# EasyEDA Pro project ProPrj_ProPrj_ProDoc_V12C_2026-06-01.epro

# Schematic Schematic2_flat_3
Board Name: Board2_oval_flat_3; Create Date: 2026-06-01; Page Name: Board2_flat_3; Project Name: ProPrj_ProDoc_最终版审核; Schematic Name: Schematic2_flat_3; Update Date: 2026-06-01; Company: EasyEDA.com; Page Size: A4; Version: V1.2WA
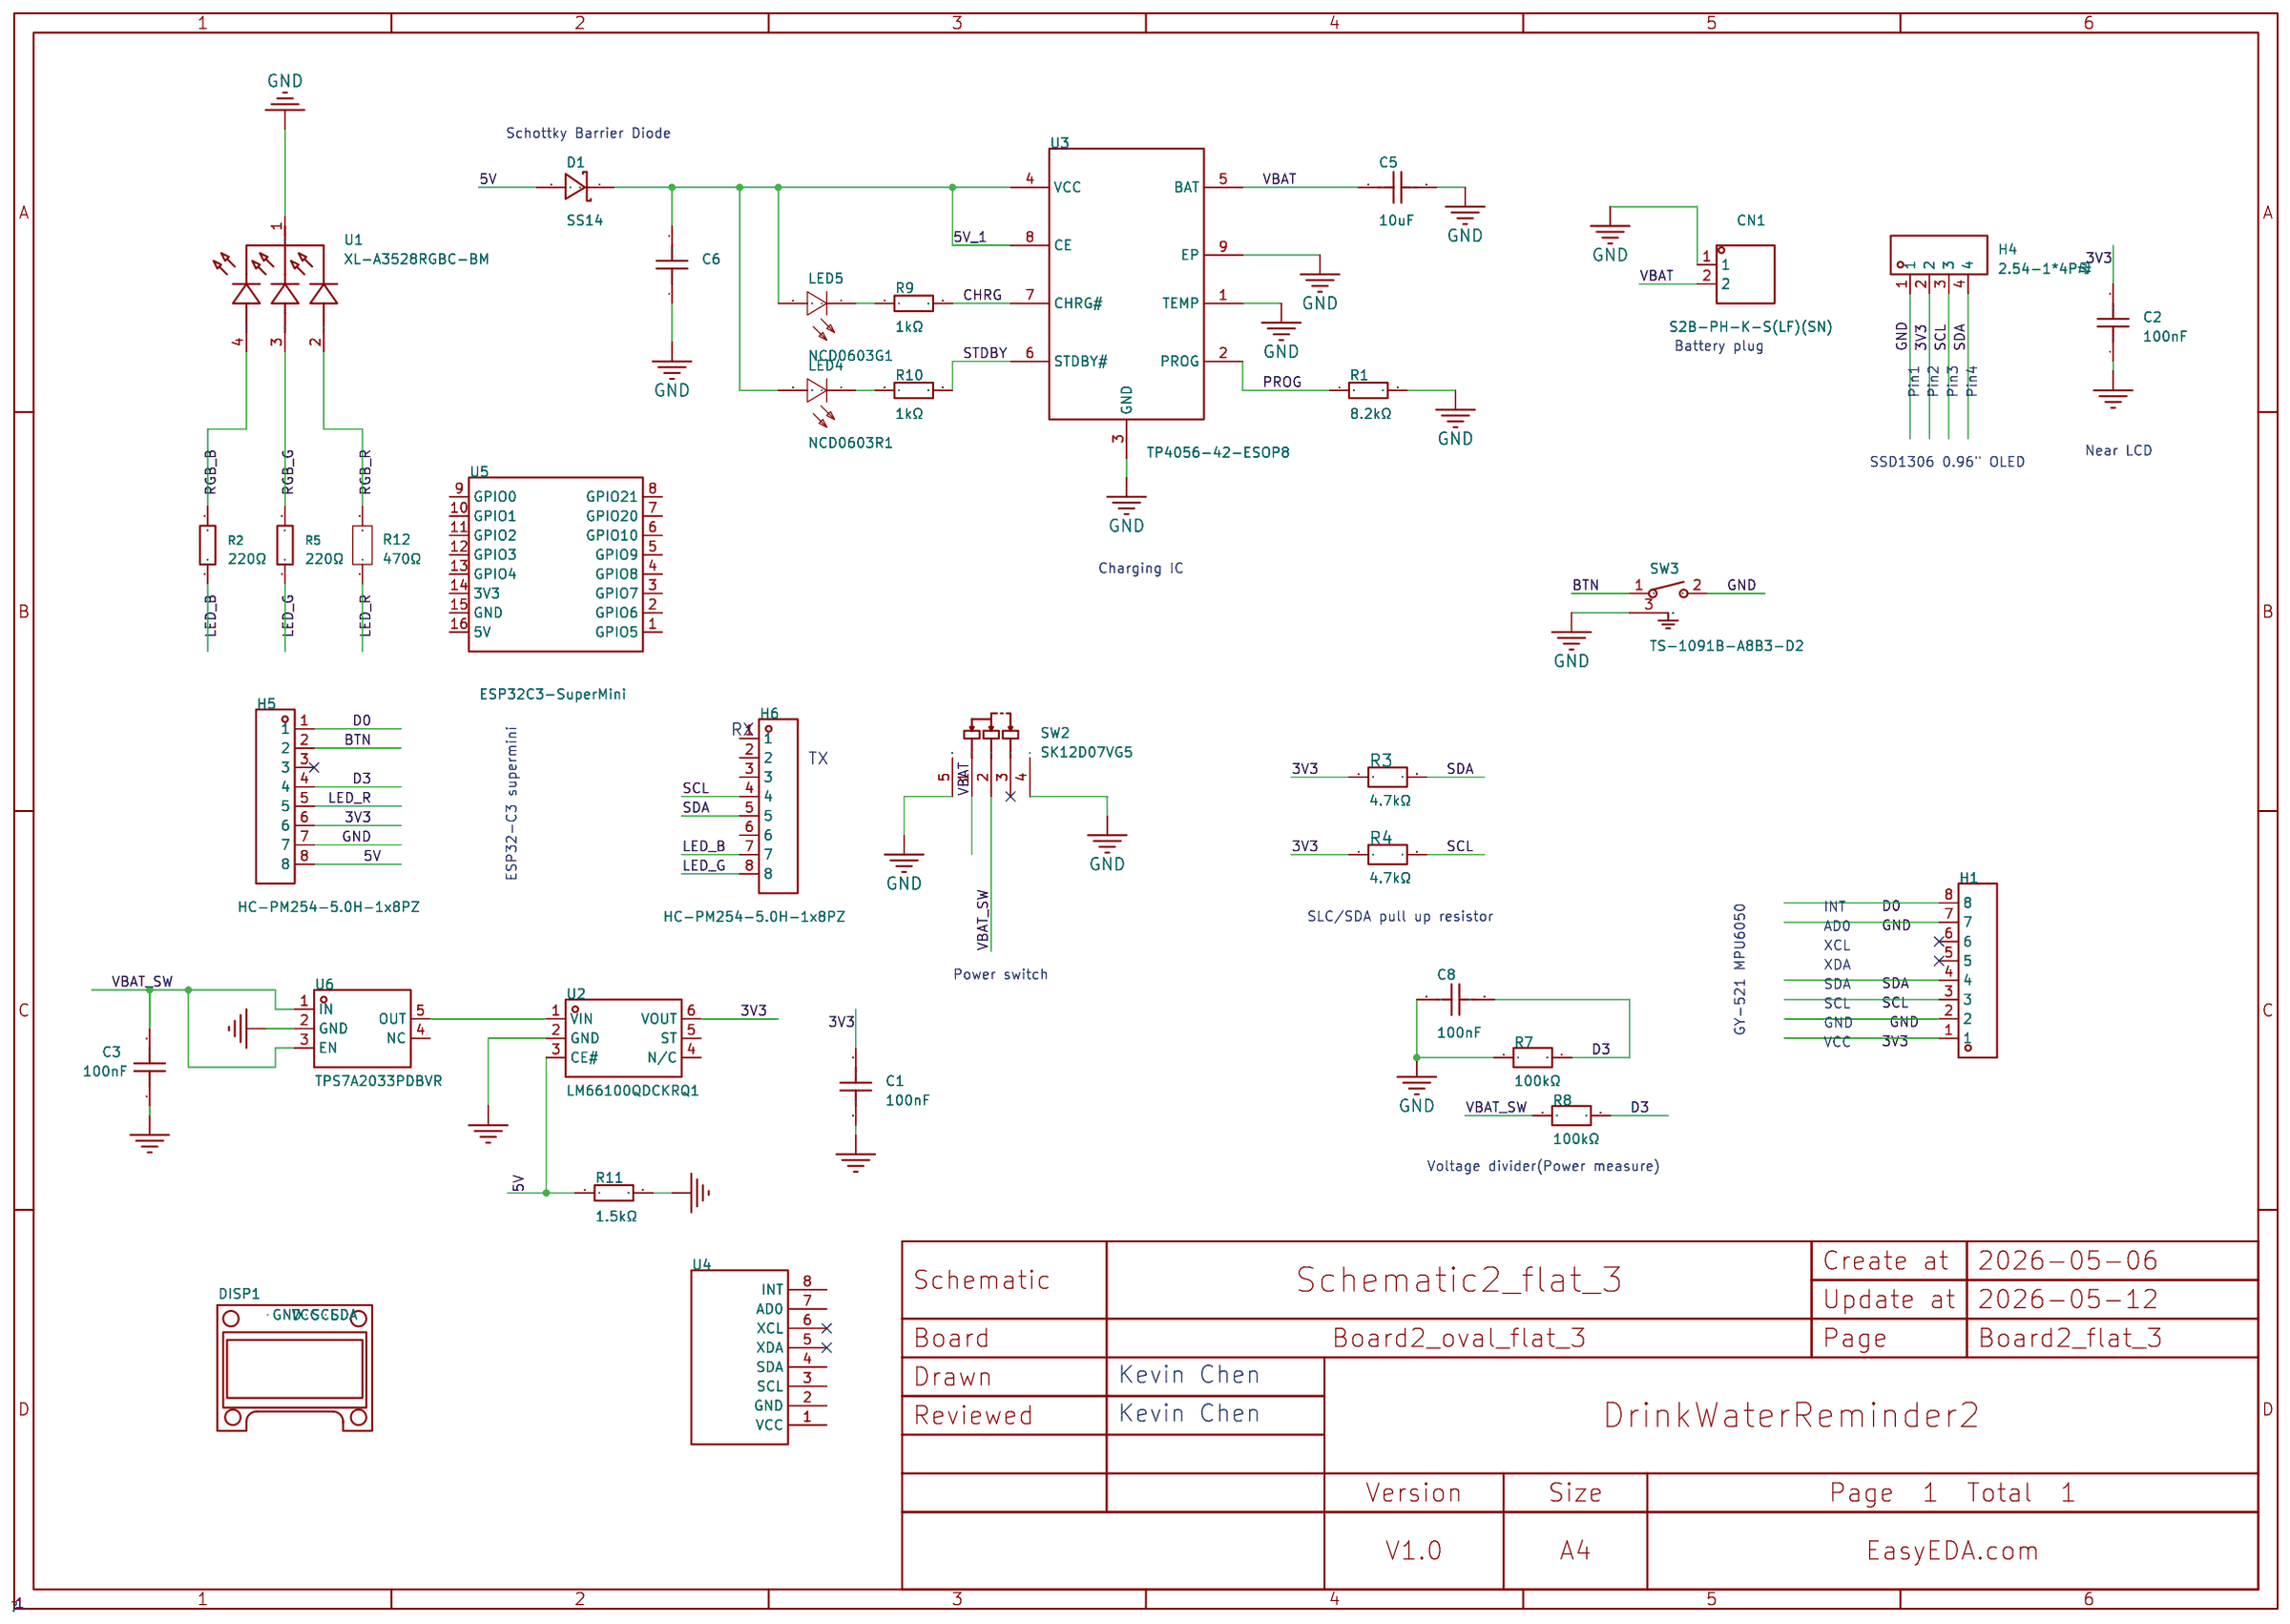
[diagram p0: schematic sheet]

## Parts
C1  100nF  [C0603]
C2  100nF  [C0603]
C3  100nF  [C0603]
C5  10uF  [C0603]
C6  10uF  [C0603]
C8  100nF  [C0603]
CN1  S2B-PH-K-S(LF)(SN)  [CONN-TH_S2B-PH-K-S-LF-SN]
D1  SS14  [SMA_L4.2-W2.6-LS5.0-RD_1]
DISP1  -  [SSD1306 OLED 128x64 Module]  (no BOM)
H1  HC-PM254-5.0H-1x8PZ  [CONN-TH_HC-PM254-1X08-8.5HZ]
H4  2.54-1*4P母  [HDR-TH_4P-P2.54-V-F]
H5  HC-PM254-5.0H-1x8PZ  [CONN-TH_HC-PM254-1X08-8.5HZ]
H6  HC-PM254-5.0H-1x8PZ  [CONN-TH_HC-PM254-1X08-8.5HZ]
LED4  NCD0603R1  [LED0603-RD_RED]
LED5  NCD0603G1  [LED0603-RD_1]
R1  8.2kΩ  [R0603]
R2  220Ω  [R0603]
R3  4.7kΩ  [R0603]
R4  4.7kΩ  [R0603]
R5  220Ω  [R0603]
R7  100kΩ  [R0603]
R8  100kΩ  [R0603]
R9  1kΩ  [R0603]
R10  1kΩ  [R0603]
R11  1.5kΩ  [R0603]
R12  470Ω  [R0603]
SW2  SK12D07VG5  [SW-TH_SK12D07VG5-1]
SW3  TS-1091B-A8B3-D2  [KEY-TH_L4.5-W6.5-P3.10_TS-1091B-A8B3-D2]
U1  XL-A3528RGBC-BM  [LED-ARRAY-SMD_4P-L3.2-W2.8-LS3.5-BL_XL-A3528RGBC-BM]
U2  LM66100QDCKRQ1  [SC-70-6_L2.0-W1.3-P0.65-LS2.1-BR]
U3  TP4056-42-ESOP8  [ESOP-8_L4.9-W3.9-P1.27-LS6.0-BL-EP]
U4  -  [MPU-6050 module]  (no BOM)
U5  ESP32C3-SuperMini  [COMM-SMD_16P-L22.5-W18.0-P2.54-TL]  (no BOM)
U6  TPS7A2033PDBVR  [SOT-23-5_L2.9-W1.6-P0.95-LS2.8-BR]

## Library data of the parts
C1-C3 = GRM188R71H104KA93D: LCSC Part Name: 100nF ±10% 50V; Supplier Part: C77055; Manufacturer: muRata(村田); Supplier Footprint: 0603; JLCPCB Part Class: Extended Part; Datasheet: https://item.szlcsc.com/datasheet/GRM188R71H104KA93D/78182.html; Supplier: LCSC; Tolerance: ±10%; Voltage Rating: 50V; Temperature Coefficient: X7R
C5 = FCC0603X106K100CT: LCSC Part Name: 10uF ±10% 10V; Supplier Part: C5137565; Manufacturer: FOJAN(富捷); Supplier Footprint: 0603; JLCPCB Part Class: Extended Part; Datasheet: https://item.szlcsc.com/datasheet/FCC0603X106K100CT/5747017.html; Supplier: LCSC; Tolerance: ±10%; Voltage Rating: 10V; Temperature Coefficient: X5R
C6 = FCC0603X106K100CT: Capacitance:10uF Tolerance:±10% Tolerance:±10% Voltage Rating:10V Temperature Coefficient:X5R; LCSC Part Name: 10uF ±10% 10V; Supplier Part: C5137565; Manufacturer: FOJAN(富捷); Supplier Footprint: 0603; JLCPCB Part Class: Extended Part; Datasheet: https://item.szlcsc.com/datasheet/FCC0603X106K100CT/5747017.html; Supplier: LCSC; Tolerance: ±10%; Voltage Rating: 10V; Temperature Coefficient: X5R
C8 = CGA0603X7R104K500JT: LCSC Part Name: 100nF ±10% 50V; Supplier Part: C6119867; Manufacturer: HRE(芯声); Supplier Footprint: 0603; JLCPCB Part Class: Extended Part; Datasheet: https://item.szlcsc.com/datasheet/CGA0603X7R104K500JT/7062573.html; Supplier: LCSC; Tolerance: ±10%; Voltage Rating: 50V; Temperature Coefficient: X7R
CN1 = S2B-PH-K-S(LF)(SN): LCSC Part Name: 1x2P 间距:2mm 弯插 系列:PH; Supplier Part: C173752; Manufacturer: JST; Supplier Footprint: 弯插,P=2mm; Datasheet: https://item.szlcsc.com/datasheet/S2B-PH-K-S(LF)(SN)/185142.html; Supplier: LCSC; Pins Structure: 1x2P; Pitch: 2mm; Mounting Type: Right Angle; Reference Series: PH; Number of Pins: 2P; Number of Rows: 1; Number of PINs Per Row: 2; Current Rating: 2A; Contact Material: Brass; Contact Plating: Tin; Operating Temperature: -25℃~+85℃; Voltage Rating: 100V; Plastic Material: PA66; Flame Retardant Rating: UL94V-0; Supplementary Features: K Pin; Color: White; Z-Height of the Board: 4.8mm; X-Length of Bottom Edge on Board (Spacing Line): 5.9mm; Y-Width of Bottom Edge on Board: 7.6mm
D1 = SS14_C2480: LCSC Part Name: 电压:40V 电流:1A; Supplier Part: C2480; Manufacturer: MDD(辰达半导体); Supplier Footprint: SMA(DO-214AC); JLCPCB Part Class: Basic Part; Datasheet: https://item.szlcsc.com/datasheet/SS14/2857.html; Supplier: LCSC; Diode Configuration: Independent; Voltage - Forward(Vf@If): 550mV@1A; Voltage - DC Reverse(Vr): 40V; Current - Rectified: 1A; Reverse Leakage Current (Ir): 300uA@40V; Operating Junction Temperature Range: -55℃~+150℃; Non-Repetitive Peak Forward Surge Current: 25A
DISP1 = SSD1306 OLED 128x64 Module: PCB Layer: Default
H1 = HC-PM254-5.0H-1x8PZ: Holes Structure:1x8P Pitch:2.54mm Row Spacing:- Circular Hole / Square Hole:Square Hole Mounting Type:Through Hole Number of Rows:1 Number of Positions:8P Current Rating:3A Voltage Rating (Max):- Holes Direction:Top Insulation Height:5mm Contact Material:; LCSC Part Name: 间距2.54mm 1x8Pin 直插 PC3.0 H5.0; Supplier Part: C27985233; Manufacturer: HC(虹成电子); Supplier Footprint: 插件,P=2.54mm; JLCPCB Part Class: Extended Part; Datasheet: https://item.szlcsc.com/datasheet/HC-PM254-5.0H-1x8PZ/29721191.html; Supplier: LCSC; Holes Structure: 1x8P; Pitch: 2.54mm; Circular Hole / Square Hole: Square Hole; Mounting Type: Through Hole; Number of Rows: 1; Number of Positions: 8P; Current Rating: 3A; Holes Direction: Top; Insulation Height: 5mm; Contact Material: Brass; Contact Plating: Gold; Operating Temperature: -40℃~+105℃; PIN Length: 3mm
H4 = 2.54-1*4P母: LCSC Part Name: 间距:2.54mm 1x4P 直插; Supplier Part: C2718488; Manufacturer: BOOMELE(博穆精密); Supplier Footprint: 插件,P=2.54mm; JLCPCB Part Class: Extended Part; Datasheet: https://item.szlcsc.com/datasheet/2.54-1*4P%25E6%25AF%258D/2834502.html; Supplier: LCSC; Holes Structure: 1x4P; Pitch: 2.54mm; Circular Hole / Square Hole: 方孔; Mounting Type: 直插; Number of Rows: 单排; Number of Positions: 4P; Current Rating: 3A; Holes Direction: 顶部; Contact Material: 青铜; Operating Temperature: -40℃~+105℃
H5 H6 = HC-PM254-5.0H-1x8PZ: LCSC Part Name: 间距2.54mm 1x8Pin 直插 PC3.0 H5.0; Supplier Part: C27985233; Manufacturer: HC(虹成电子); Supplier Footprint: 插件,P=2.54mm; JLCPCB Part Class: Extended Part; Datasheet: https://item.szlcsc.com/datasheet/HC-PM254-5.0H-1x8PZ/29721191.html; Supplier: LCSC; Holes Structure: 1x8P; Pitch: 2.54mm; Circular Hole / Square Hole: Square Hole; Mounting Type: Through Hole; Number of Rows: 1; Number of Positions: 8P; Current Rating: 3A; Holes Direction: Top; Insulation Height: 5mm; Contact Material: Brass; Contact Plating: Gold; Operating Temperature: -40℃~+105℃; PIN Length: 3mm
LED4 = NCD0603R1_C84263: Lamp Holder Type:- Illumination Color:Red Voltage - Forward(Vf):1.6V~2.6V Voltage - Forward(Vf):1.6V~2.6V Power(Watts):65mW Forward Current:25mA Wavelength - Dominant:615nm~630nm Wavelength - Dominant:615nm~630nm Peak Wavelength:630nm Diode Configuration:; LCSC Part Name: 片式发光二极管; Supplier Part: C84263; Manufacturer: 国星光电; Supplier Footprint: 0603; JLCPCB Part Class: Extended Part; Datasheet: https://item.szlcsc.com/datasheet/NCD0603R1/85432.html; Supplier: LCSC; Illumination Color: Red; Voltage - Forward(Vf): 1.6V~2.6V; Power(Watts): 65mW; Forward Current: 25mA; Wavelength - Dominant: 615nm~630nm; Peak Wavelength: 630nm; Diode Configuration: Discrete Diode; Luminous Intensity: 220mcd; Viewing Angle: 130°; Operating Temperature: -30℃~+85℃
LED5 = NCD0603G1: Lamp Holder Type:- Illumination Color:Emerald Green Voltage - Forward(Vf):2.6V~3.6V Voltage - Forward(Vf):2.6V~3.6V Power(Watts):72mW Forward Current:20mA Wavelength - Dominant:515nm~530nm Wavelength - Dominant:515nm~530nm Peak Wavelength:520nm Diode Conf; LCSC Part Name: 片式发光二极管; Supplier Part: C84267; Manufacturer: 国星光电; Supplier Footprint: 0603; JLCPCB Part Class: Extended Part; Datasheet: https://item.szlcsc.com/datasheet/NCD0603G1/85436.html; Supplier: LCSC; Illumination Color: Emerald Green; Voltage - Forward(Vf): 2.6V~3.6V; Power(Watts): 72mW; Forward Current: 20mA; Wavelength - Dominant: 515nm~530nm; Peak Wavelength: 520nm; Diode Configuration: Discrete Diode; Luminous Intensity: 900mcd; Viewing Angle: 130°; Operating Temperature: -30℃~+85℃
R1 = RC0603FR-078K2L: LCSC Part Name: 厚膜电阻 8.2kΩ ±1% 100mW; Supplier Part: C114637; Manufacturer: YAGEO(国巨); Supplier Footprint: 0603; JLCPCB Part Class: Extended Part; Datasheet: https://atta.szlcsc.com/upload/public/pdf/source/20180821/C275644_0D56F95EFF785E7D9A1FEF436B37DA78.pdf; Supplier: LCSC; Type: 厚膜电阻; Tolerance: ±1%; Power(Watts): 100mW; Overload Voltage (Max): 75V; Temperature Coefficient: ±100ppm/℃; Operating Temperature Range: -55℃~+155℃
R2 R5 = CR0603FA2200G: LCSC Part Name: 厚膜电阻 220Ω ±1% 100mW; Supplier Part: C100863; Manufacturer: LIZ(丽智电子); Supplier Footprint: 0603; JLCPCB Part Class: Extended Part; Datasheet: https://item.szlcsc.com/datasheet/CR0603FA2200G/102078.html; Supplier: LCSC; Type: Thick Film Resistor; Tolerance: ±1%; Power(Watts): 100mW; Voltage-Supply(Max): 50V; Temperature Coefficient: ±100ppm/℃; Operating Temperature: -55℃~+125℃
R3 R4 = FRC0603J472 TS: LCSC Part Name: 4.7kΩ ±5% 100mW 厚膜电阻; Supplier Part: C2907166; Manufacturer: FOJAN(富捷); Supplier Footprint: 0603; JLCPCB Part Class: Extended Part; Supplier: LCSC; Type: Thick Film Resistor; Tolerance: ±5%; Power(Watts): 100mW; Voltage-Supply(Max): 75V; Temperature Coefficient: ±100ppm/℃; Operating Temperature: -55℃~+155℃
R7 R8 = FRC0603J104 TS: LCSC Part Name: 100kΩ ±5% 100mW 厚膜电阻; Supplier Part: C2907088; Manufacturer: FOJAN(富捷); Supplier Footprint: 0603; JLCPCB Part Class: Extended Part; Supplier: LCSC; Type: Thick Film Resistor; Tolerance: ±5%; Power(Watts): 100mW; Voltage-Supply(Max): 75V; Temperature Coefficient: ±100ppm/℃; Operating Temperature: -55℃~+155℃
R9 R10 = 0603WAF1001T5E: LCSC Part Name: 1kΩ ±1% 100mW 厚膜电阻; Supplier Part: C21190; Manufacturer: UNI-ROYAL(厚声); Supplier Footprint: 0603; JLCPCB Part Class: Basic Part; Datasheet: https://item.szlcsc.com/datasheet/0603WAF1001T5E/21904.html; Supplier: LCSC; Type: Thick Film Resistor; Tolerance: ±1%; Power(Watts): 100mW; Voltage-Supply(Max): 75V; Temperature Coefficient: ±100ppm/℃; Operating Temperature: -55℃~+155℃
R11 = RC0603JR-071K5L: LCSC Part Name: 厚膜电阻 1.5kΩ ±5% 100mW; Supplier Part: C114680; Manufacturer: YAGEO(国巨); Supplier Footprint: 0603; JLCPCB Part Class: Extended Part; Datasheet: https://item.szlcsc.com/datasheet/RC0603JR-071K5L/115924.html; Supplier: LCSC; Type: 厚膜电阻; Tolerance: ±5%; Power(Watts): 100mW; Voltage-Supply(Max): 75V; Temperature Coefficient: ±100ppm/℃; Operating Temperature: -55℃~+155℃
R12 = FRC0603J471 TS: Type:Thick Film Resistor Resistance:470Ω Tolerance:±5% Tolerance:±5% Power(Watts):100mW Voltage-Supply(Max):75V Temperature Coefficient:±100ppm/℃ Temperature Coefficient:±100ppm/℃ Operating Temperature:-55℃~+155℃ Operating Temperature:-55℃~+155℃; LCSC Part Name: 470Ω ±5% 100mW 厚膜电阻; Supplier Part: C2907172; Manufacturer: FOJAN(富捷); Supplier Footprint: 0603; JLCPCB Part Class: Extended Part; Supplier: LCSC; Type: Thick Film Resistor; Tolerance: ±5%; Power(Watts): 100mW; Voltage-Supply(Max): 75V; Temperature Coefficient: ±100ppm/℃; Operating Temperature: -55℃~+155℃
SW2 = SK12D07VG5: Supplier Part: C431548; Manufacturer: SHOU HAN(首韩); Supplier Footprint: 插件,8.7x4.4mm; JLCPCB Part Class: Extended Part; Datasheet: https://item.szlcsc.com/datasheet/SK12D07VG5/427905.html; Supplier: LCSC; Circuit: SPDT; Termination Style: PC Pin; Length: 8.7mm; Width: 4.4mm; Switch Height: 4.7mm; Current Rating: 500mA; Voltage Rating: 50V; Life: 5,000 cycles; Operating Temperature: -10℃~+50℃
SW3 = TS-1091B-A8B3-D2: LCSC Part Name: 4.5*4.5*7mm 卧插 轻触开关; Supplier Part: C557914; Manufacturer: Yuandi(元迪); Supplier Footprint: 插件; JLCPCB Part Class: Extended Part; Datasheet: https://atta.szlcsc.com/upload/public/pdf/source/20230810/62360E7201003165247F8ABBA84191C1.pdf; Supplier: LCSC; Circuit: SPST; Actuator Style: Round Button; Operating Force: 250gf; Mounting Style: Lying; Switch Length: 4.5mm; Switch Width: 4.5mm; Switch Height: 7mm; Strike Gundam: 不带; Actuator/Cap Color: Black; Pin Style: PCPin
U1 = XL-A3528RGBC-BM: LCSC Part Name: 3528七彩贴片式发光二极管; Supplier Part: C3647023; Manufacturer: XINGLIGHT(成兴光); Supplier Footprint: SMD3528-4P; JLCPCB Part Class: Extended Part; Datasheet: https://item.szlcsc.com/datasheet/XL-A3528RGBC-BM/4213938.html; Supplier: LCSC; Diode Configuration: 共阴极; Wavelength - Dominant: B:460nm~470nm；G:515nm~530nm；R:620nm~630nm; Peak Wavelength: G:520nm；B:460nm；R:620nm; Luminous Intensity: G:1300mcd~1800mcd；B:400mcd~500mcd；R:500mcd~600mcd; Viewing Angle: 120°; Lens Color: 无色透明透镜; Forward Current: R:20mA；B:20mA；G:20mA; Forward Voltage(Vf): B:2.8V~3.2V；G:2.8V~3.2V；R:1.8V~2.2V; Antistatic Capacity: B:2000V；R:2000V；G:2000V; Power(Watts): G:70mW；B:70mW；R:50mW; Installation Method: 正贴; Operating Temperature: -40℃~+85℃; Length: 3.5mm; Width: 2.8mm; Height: 1.9mm
U2 = LM66100QDCKRQ1: LCSC Part Name: 具有集成式 FET 的汽车类 1.5V 至 5.5V、1.5A、0.5uA IQ 理想二极管; Supplier Part: C5219211; Manufacturer: TI(德州仪器); Supplier Footprint: SC-70-6; JLCPCB Part Class: Extended Part; Datasheet: https://www.ti.com/cn/lit/gpn/lm66100-q1; Supplier: LCSC
U3 = TP4056-42-ESOP8: LCSC Part Name: 1A线性锂离子电池充电器; Supplier Part: C16581; Manufacturer: TOPPOWER(南京拓微); Supplier Footprint: ESOP-8; JLCPCB Part Class: Extended Part; Datasheet: https://item.szlcsc.com/datasheet/TP4056-42-ESOP8/17264.html; Supplier: LCSC; The Chip Type: Charging IC; Voltage - Supply: 4V~8V; Charge Current - Max: 1A; Charging Saturation Voltage: 4.2V; Type of Battery: Lithium Battery; Number of Cells: 1; Operating Temperature: -40℃~+85℃; Battery Temperature Detection: Support; Supply Current (Iq): 2uA; Features: Constant voltage charging；Constant current charging；Automatic recharge；Charge termination；Soft start；Programmable charging current；Undervoltage lockout；Trickle charging
U4 = MPU-6050 module
U5 = ESP32C3-SuperMini: Supplier Part: C9900147397; Supplier Footprint: SMD-16P; JLCPCB Part Class: Extended Part; Supplier: LCSC
U6 = TPS7A2033PDBVR: LCSC Part Name: 具有高 PSRR 的 300mA、超低噪声、低 IQ、低压降 (LDO) 线性稳压器; Supplier Part: C2862740; Manufacturer: TI(德州仪器); Supplier Footprint: SOT-23-5; JLCPCB Part Class: Extended Part; Datasheet: https://www.ti.com/cn/lit/gpn/tps7a20; Supplier: LCSC; Output Type: 固定; Maximum Input Voltage: 6V; Output Voltage: 3.3V; Output Current: 300mA; Dropout Voltage: 140mV@(300mA); standby current: 15uA; Feature: 防静电保护；软启动；浪涌保护；低ESR；热保护(TSD)；欠压闭锁；过流保护(OCP)；带使能；防倒灌; Operating Temperature: -40℃~+125℃@(Tj); Output Polarity: 正极; Number of Outputs: 1

## Nets
3V3: C1.2 C2.2 H1.1 H4.2 H5.6 R3.1 R4.1 U2.6(VOUT)
5V: D1.2(A) H5.8 R11.1 U2.3(CE#)
5V_1: C6.2 D1.1(K) LED4.2(A) LED5.2(A) U3.4(VCC) U3.8(CE)
GND: C1.1 C2.1 C3.1 C5.2 C6.1 C8.1 CN1.1 H1.2 H1.7 H4.1 H5.7 R1.2 R7.1 R11.2 SW2.4 SW2.5 SW3.2 SW3.3(GND) U1.1 U2.2(GND) U3.1(TEMP) U3.3(GND) U3.9(EP) U6.2(GND)
VBAT: C5.1 CN1.2 SW2.1 U3.5(BAT)
VBAT_SW: C3.2 R8.1 SW2.2 U6.1(IN) U6.3(EN)
BTN: H5.2 SW3.1
CHRG: R9.2 U3.7(CHRG#)
D0: H1.8 H5.1
D3: C8.2 H5.4 R7.2 R8.2
LED_B: H6.7 R2.1
LED_G: H6.8 R5.1
LED_R: H5.5 R12.1
PROG: R1.1 U3.2(PROG)
RGB_B: R2.2 U1.4
RGB_G: R5.2 U1.3
RGB_R: R12.2 U1.2
SCL: H1.3 H4.3 H6.4 R4.2
SDA: H1.4 H4.4 H6.5 R3.2
STDBY: R10.2 U3.6(STDBY#)
$1N21492: LED5.1(K) R9.1
$1N21493: LED4.1(K) R10.1
$1N21507: U2.1(VIN) U6.5(OUT)

Not connected (* = marked no-connect by the designer): DISP1 1(GND) 2(VCC) 3(SCL) 4(SDA); H1 5* 6*; H5 3*; H6 1 2 3 6; SW2 3*; U2 4(N/C) 5(ST); U4 1(VCC) 2(GND) 3(SCL) 4(SDA) 5(XDA)* 6(XCL)* 7(AD0) 8(INT); U5 1(GPIO5) 2(GPIO6) 3(GPIO7) 4(GPIO8) 5(GPIO9) 6(GPIO10) 7(GPIO20) 8(GPIO21) 9(GPIO0) 10(GPIO1) 11(GPIO2) 12(GPIO3) 13(GPIO4) 14(3V3) 15(GND) 16(5V); U6 4(NC)

## Notes on the sheet
- Schottky Barrier Diode
- Battery plug
- Pin1
- Pin2
- Pin3
- Pin4
- SSD1306 0.96" OLED
- Near LCD
- Charging IC
- RX
- TX
- ESP32-C3 supermini
- SLC/SDA pull up resistor
- INT
- AD0
- XCL
- XDA
- Power switch
- SDA
- SCL
- GND
- GY-521 MPU6050
- VCC
- Voltage divider(Power measure)
- Kevin Chen
- Kevin Chen

# Board Board2_flat_3
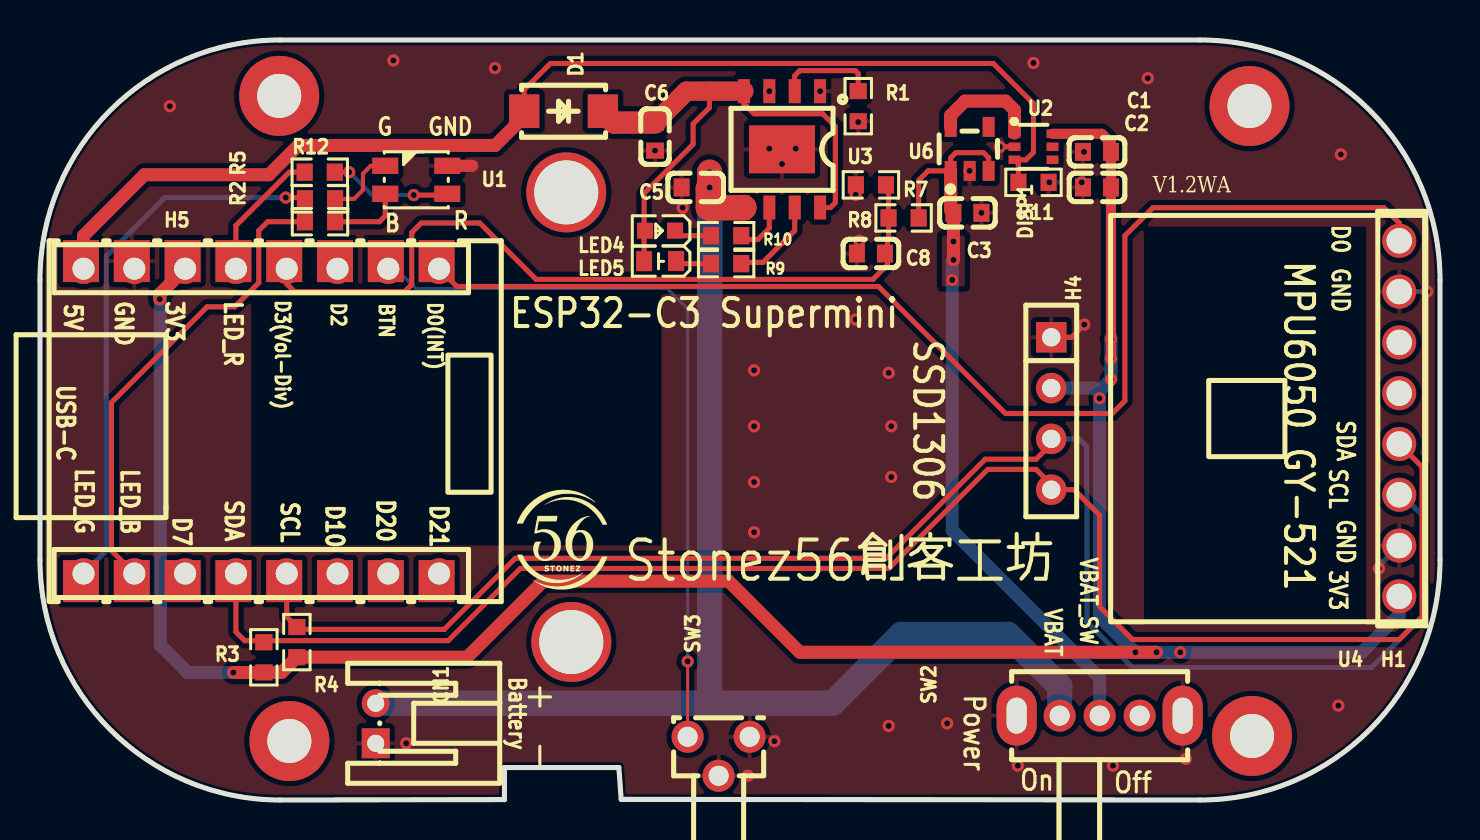
[diagram p1: board, top side]
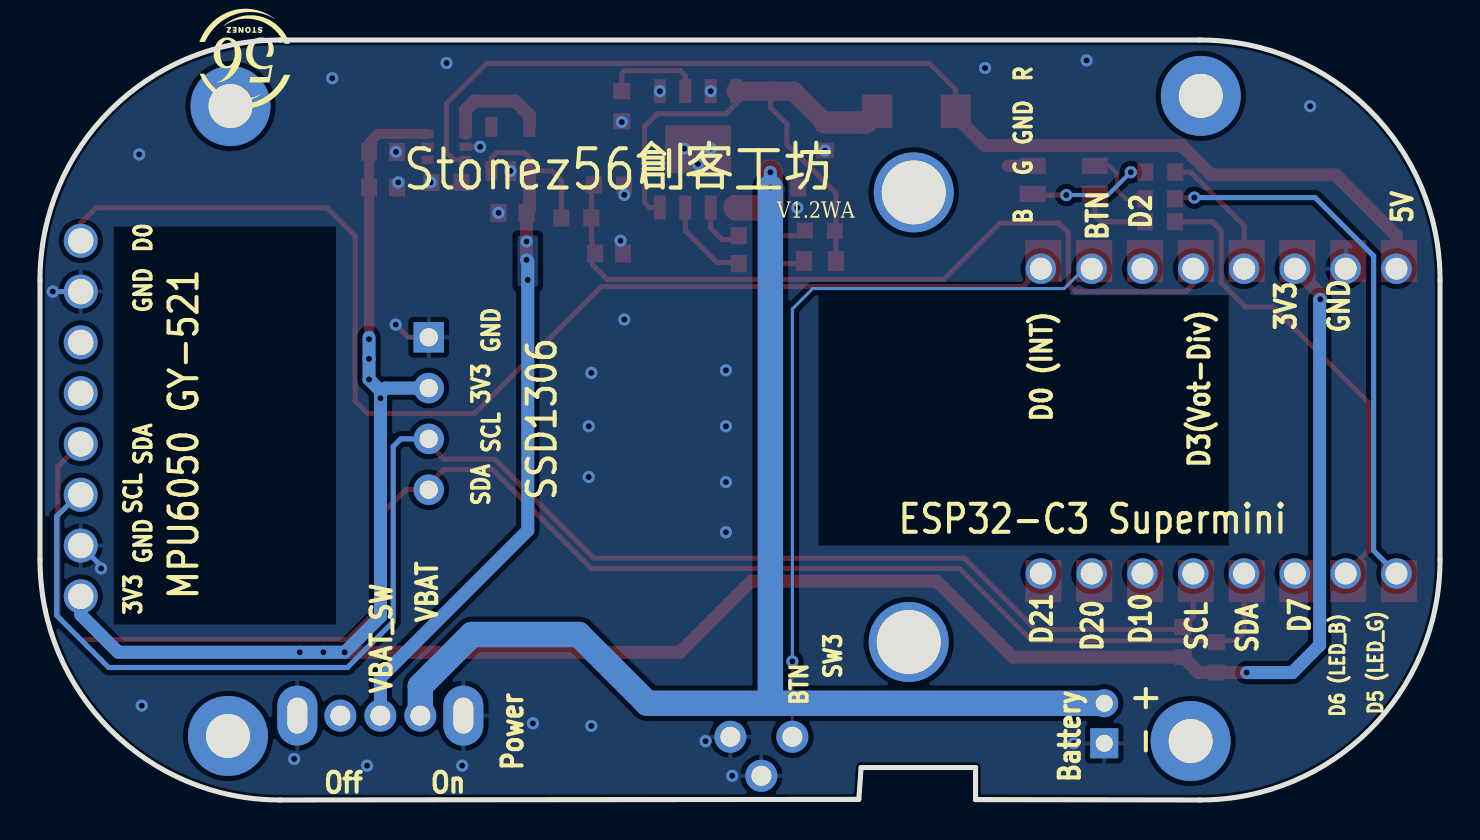
[diagram p2: board, bottom side, seen from below]

Outline 70 x 38 mm; copper layers: Top Layer, Bottom Layer. Coordinates in mm from the lower left corner of the outline.
Outline path: 0,26 arc(3.51,34.49) 12,38 58,38 arc(66.49,34.49) 70,26 70,12 arc(66.49,3.51) 58,0 29.06,0.03 28.94,1.62 23.22,1.62 23.22,0.02 12,0 arc(3.51,3.51) 0,12 0,26
Stack: Top Layer 0.035mm / Dielectric1 1.51mm FR4 er 4.5 / Bottom Layer 0.035mm

## Design rules (mm)
spacing copperThickness1oz (default): track to track 0.102, other pairs 0.152 to 0.3
spacing copperThickness2oz: track to track 0.203, other pairs 0.152 to 0.3
spacing Plane_innerPlane: track to track 0.102, other pairs 0.152 to 0.3
spacing Copper_copperRegion: track to track 0.102, other pairs 0.152 to 0.3
track width copperThickness1oz (default): min 0.127, default 0.254, max 2.54
track width copperThickness2oz: min 0.203, default 0.254, max 2.54
track width Power_lines: min 0.127, default 0.65, max 2.54
differential pair differentialPair (default): width min 0.127, default 0.254, max 2.54; gap min 0.152, default 0.152
via viaSize (default): diameter min 0.5, default 0.61, max 10; hole min 0.3, default 0.305, max 6.3
net 5V uses Power_lines
net VBAT uses Power_lines
net VBAT_SW uses Power_lines, copperRegion_copperThickness1oz
net 3V3 uses Power_lines
pour e473 uses Copper_copperRegion, copperRegion_Copper_copperRegion
pour e475 uses Copper_copperRegion, copperRegion_Copper_copperRegion

## Placement (name value [footprint] x y rotation side)
C1  100nF  [C0603]  52.85 32.41 0 top
C2  100nF  [C0603]  52.85 30.63 0 top
C3  100nF  [C0603]  46.37 29.36 180 top
C5  10uF  [C0603]  32.78 30.63 180 top
C6  10uF  [C0603]  30.75 33.17 90 top
C8  100nF  [C0603]  41.55 27.33 0 top
CN1  S2B-PH-K-S(LF)(SN)  [CONN-TH_S2B-PH-K-S-LF-SN]  16.79 3.84 270 top
D1  SS14  [SMA_L4.2-W2.6-LS5.0-RD_1]  26.18 34.44 180 top
DISP1  -  [SSD1306 OLED 128x64 Module]  39.39 19.33 270 top
H1  HC-PM254-5.0H-1x8PZ  [CONN-TH_HC-PM254-1X08-8.5HZ]  68.09 19.07 90 top
H4  2.54-1*4P母  [HDR-TH_4P-P2.54-V-F]  50.56 19.45 270 top
H5  HC-PM254-5.0H-1x8PZ  [CONN-TH_HC-PM254-1X08-8.5HZ#2]  11.07 26.56 180 top
H6  HC-PM254-5.0H-1x8PZ  [CONN-TH_HC-PM254-1X08-8.5HZ#2]  11.07 11.32 180 top
LED4  NCD0603R1  [LED0603-RD_RED]  31.01 28.47 180 top
LED5  NCD0603G1  [LED0603-RD_1]  31.01 26.95 180 top
NOREF  -  [Pad_e202]  26.31 30.38 270 top
NOREF#2  -  [Pad_e197]  60.6 3.2 270 top
NOREF#3  -  [Pad_e199]  11.96 35.21 270 top
NOREF#4  -  [Pad_e200]  12.47 2.95 270 top
NOREF#5  -  [Pad_e201]  26.57 7.9 270 top
NOREF#6  -  [Pad_e198]  60.48 34.7 270 top
R1  8.2kΩ  [R0603]  40.91 34.69 270 top
R2  220Ω  [R0603]  14 28.91 0 top
R3  4.7kΩ  [R0603]  11.19 7.13 90 top
R4  4.7kΩ  [R0603]  12.84 7.89 90 top
R5  220Ω  [R0603]  14 30.06 0 top
R7  100kΩ  [R0603]  41.55 30.75 0 top
R8  100kΩ  [R0603]  43.18 29.1 180 top
R9  1kΩ  [R0603]  34.31 26.82 0 top
R10  1kΩ  [R0603]  34.31 28.22 0 top
R11  1.5kΩ  [R0603]  49.67 30.88 0 top
R12  470Ω  [R0603]  13.99 31.39 0 top
SW2  SK12D07VG5  [SW-TH_SK12D07VG5-1]  52.98 4.22 0 top
SW3  TS-1091B-A8B3-D2  [KEY-TH_L4.5-W6.5-P3.10_TS-1091B-A8B3-D2]  33.93 2.19 0 top
U1  XL-A3528RGBC-BM  [LED-ARRAY-SMD_4P-L3.2-W2.8-LS3.5-BL_XL-A3528RGBC-BM]  18.81 31.01 180 top
U2  LM66100QDCKRQ1  [SC-70-6_L2.0-W1.3-P0.65-LS2.1-BR]  49.67 32.66 180 top
U3  TP4056-42-ESOP8  [ESOP-8_L4.9-W3.9-P1.27-LS6.0-BL-EP]  37.1 32.53 180 top
U4  -  [MPU-6050 module]  67.96 10.18 180 top
U5  ESP32C3-SuperMini  [COMM-SMD_16P-L22.5-W18.0-P2.54-TL]  10.94 18.94 90 top
U6  TPS7A2033PDBVR  [SOT-23-5_L2.9-W1.6-P0.95-LS2.8-BR]  46.48 32.56 270 top

## Footprints (pads in the part's own frame, mm; a bottom-side part is the same pattern mirrored in y, then rotated)
C0603
  rect 0.8x0.9 smd: 1(-0.7,0) 2(0.7,0)
COMM-SMD_16P-L22.5-W18.0-P2.54-TL
  rect 2.102x1.802 smd: 1(-8.001,8.89) 2(-8.001,6.35) 3(-8.001,3.81) 4(-8.001,1.27) 5(-8.001,-1.27) 6(-8.001,-3.81) 7(-8.001,-6.35) 8(-8.001,-8.89) 9(8.001,-8.89) 10(8.001,-6.35) 11(8.001,-3.81) 12(8.001,-1.27) 13(8.001,1.27) 14(8.001,3.81) 15(8.001,6.35) 16(8.001,8.89)
CONN-TH_HC-PM254-1X08-8.5HZ#2
  round 1.524 hole 1.1: 1(-8.89,0) 2(-6.35,0) 3(-3.81,0) 4(-1.27,0) 5(1.27,0) 6(3.81,0) 7(6.35,0) 8(8.89,0)
CONN-TH_S2B-PH-K-S-LF-SN
  rect 1.5x1.4 hole 0.85: 1(1,0)
  round 1.4 hole 0.85: 2(-1,0)
ESOP-8_L4.9-W3.9-P1.27-LS6.0-BL-EP
  rect 0.6x1.2 smd: 1(-1.905,-2.909) 2(-0.635,-2.909) 3(0.635,-2.909) 4(1.905,-2.909) 5(1.905,2.909) 6(0.635,2.909) 7(-0.635,2.909) 8(-1.905,2.909)
  rect 3.3x2.4 smd: 9(0,0)
KEY-TH_L4.5-W6.5-P3.10_TS-1091B-A8B3-D2
  round 1.6 hole 1: 1(-1.55,0.975) 2(1.55,0.975) 3(0,-0.975)
LED0603-RD_1
  rect 0.8x1 smd: 1(-0.799,-0.004) 2(0.799,0.004)
LED0603-RD_RED
  rect 0.8x0.8 smd: 1(-0.749,-0.004) 2(0.749,0.004)
LED-ARRAY-SMD_4P-L3.2-W2.8-LS3.5-BL_XL-A3528RGBC-BM
  rect 1.3x0.82 smd: 1(-1.55,-0.7) 2(-1.55,0.7) 3(1.55,-0.7) 4(1.55,0.7)
MPU-6050 module
  round 1.7 hole 1.27x1.1: 1(0,0) 2(0,-2.54) 3(0,-5.08) 4(0,-7.62) 5(0,-10.16) 6(0,-12.7) 7(0,-15.24) 8(0,-17.78)
Pad_e197
  round 4 hole 2.2: 1(0,0)
Pad_e198
  round 4 hole 2.2: 2(0,0)
Pad_e199
  round 4 hole 2.2: 3(0,0)
Pad_e200
  round 4 hole 2.2: 4(0,0)
Pad_e201
  round 4 hole 3.2: 5(0,0)
Pad_e202
  round 4 hole 3.2: 6(0,0)
R0603
  rect 0.806x0.864 smd: 1(-0.753,0) 2(0.753,0)
SC-70-6_L2.0-W1.3-P0.65-LS2.1-BR
  rect 0.6x0.42 smd: 1(0.95,-0.65) 2(0.95,0) 3(0.95,0.65) 4(-0.95,0.65) 5(-0.95,0) 6(-0.95,-0.65)
SMA_L4.2-W2.6-LS5.0-RD_1
  rect 1.52x1.68 smd: 1(-1.965,0) 2(1.965,0)
SOT-23-5_L2.9-W1.6-P0.95-LS2.8-BR
  rect 1x0.6 smd: 1(1.1,-0.95) 2(1.1,0) 3(1.1,0.95) 4(-1.1,0.95) 5(-1.1,-0.95)
SSD1306 OLED 128x64 Module
  rect 1.524x1.524 hole 0.914: 1(-3.81,11.176)
  round 1.524 hole 0.914: 2(-1.27,11.176) 3(1.27,11.176) 4(3.81,11.176)
SW-TH_SK12D07VG5-1
  oval 1.6x1.6 hole 1: 1(-2,0) 2(0,0) 3(2,0)
  oval 2x3 hole 1x1.8: 4(4.15,0) 5(-4.15,0)

## Nets
3V3: C1.2 C2.2 DISP1.2 H5.6 R3.1 R4.1 U2.6 U4.1 U5.14
5V: D1.2 H5.8 R11.1 U2.3 U5.16
5V_1: C6.2 D1.1 LED4.2 LED5.2 U3.4 U3.8
GND: C1.1 C2.1 C3.1 C5.2 C6.1 C8.1 CN1.1 DISP1.1 H5.7 R1.2 R7.1 R11.2 SW2.4 SW2.5 SW3.2 SW3.3 U1.1 U2.2 U3.1 U3.3 U3.9 U4.2 U4.7 U5.15 U6.2
VBAT: C5.1 CN1.2 SW2.1 U3.5
VBAT_SW: C3.2 R8.1 SW2.2 U6.1 U6.3
BTN: H5.2 SW3.1 U5.10
CHRG: R9.2 U3.7
D0: H5.1 U4.8 U5.9
D3: C8.2 H5.4 R7.2 R8.2 U5.12
LED_B: H6.7 R2.1 U5.2
LED_G: H6.8 R5.1 U5.1
LED_R: H5.5 R12.1 U5.13
PROG: R1.1 U3.2
RGB_B: R2.2 U1.4
RGB_G: R5.2 U1.3
RGB_R: R12.2 U1.2
SCL: DISP1.3 H6.4 R4.2 U4.3 U5.5
SDA: DISP1.4 H6.5 R3.2 U4.4 U5.4
STDBY: R10.2 U3.6
$1N21492: LED5.1 R9.1
$1N21493: LED4.1 R10.1
$1N21507: U2.1 U6.5

Pads without a net: H5 3; H6 1 2 3 6; NOREF 6; NOREF#2 1; NOREF#3 3; NOREF#4 4; NOREF#5 5; NOREF#6 2; SW2 3; U2 4 5; U4 5 6; U5 3 6 7 8 11; U6 4

## Via types
v1: diameter 0.61, hole 0.305, Top Layer to Bottom Layer, 60 vias

## Routing (per net, layer and track width the routed paths; a pad name or vN(x,y) marks a point on that pad's centre or on a via; arc(x,y) is an arc through that point)
3V3: length 121.2
  Top Layer w0.508: v1(53.55,22.05) v1(53.55,23.04) C1.2 53.55,32.85 53.09,33.31 U2.6
  Top Layer w0.65: v1(9.67,6.37) 11.18,6.37 R3.1 12.08,6.38 R4.1 21.36,7.14 25.16,10.94 34.43,10.94 37.99,7.39 v1(54.77,7.39) v1(55.83,7.39) ; H5.6 5.99,25.29 v1(5.99,25.04)
  Bottom Layer w0.65: 52.98,20.34 52.72,20.59 DISP1.2 ; 52.98,20.34 v1(52.98,20.09) 52.98,9.17 54.75,7.39 v1(55.83,7.39) v1(57.01,7.39) 66.09,7.39 67.96,9.26 U4.1 ; 52.98,20.34 52.98,20.46 v1(53.55,21.03) v1(53.55,22.05) 53.55,23.14 ; v1(9.67,6.37) 7.38,6.37 6.02,7.74 6.02,25.01 v1(5.99,25.04)
5V: length 59.1
  Top Layer w0.254: 24.21,34.18 24.21,35.52 25.52,36.83 47.67,36.83 49.67,34.82 49.67,32.39 49.3,32.01 U2.3 48.92,31.81 R11.1
  Top Layer w0.65: H5.8 2.18,28.22 5.22,31.26 11.45,31.26 12.91,32.73 22.76,32.73 24.21,34.18
5V_1: length 28.1
  Top Layer w0.254: LED5.2 30.21,30.34 32.66,32.79 32.66,33.8 33.47,34.62 33.47,35.44 ; U3.8 39.53,29.62 39.77,29.87 39.77,33.68 39.13,34.31 35.7,34.31 35.2,34.82 U3.4
  Top Layer w0.965: C6.2 32.32,35.44 U3.4
  Top Layer w1.117: C6.2 28.71,33.87 D1.1
GND: length 6.8
  Top Layer w0.254: U2.2 v1(47.99,32.66) ; v1(52.21,23.77) 51.58,23.14 DISP1.1
  Top Layer w0.61: U1.1 21.61,31.71
  Bottom Layer w0.254: U4.2 66.95,11.7 v1(66.95,11.58) ; 67.96,25.42 v1(69.36,25.42)
  vias: v1(6.49,34.69) v1(17.67,36.98) v1(18.31,2.84) v1(22.75,36.6) v1(30.75,32.47) v1(32.13,29.61) v1(35.39,1.21) v1(35.7,21.48) v1(35.7,18.69) v1(35.7,15.9) v1(35.7,13.39) v1(36.47,35.44) v1(36.47,32.57) v1(36.72,2.94) v1(37.1,31.8) v1(37.79,32.57) v1(39.01,35.44) v1(40.78,30.26) v1(40.78,24.02) v1(40.91,33.9) v1(40.97,27.96) v1(42.43,21.36) v1(42.43,3.7) v1(42.56,18.69) v1(42.56,16.15) v1(45.36,3.83) v1(46.48,31.46) v1(47.07,29.36) v1(48.89,1.72) v1(49.67,36.85) v1(50.47,30.88) v1(52.09,30.88) v1(52.2,32.41) v1(53.65,1.72) v1(55.39,36.09) v1(57.29,2.05) v1(64.91,4.72) v1(65.04,32.28)
VBAT: length 68.4
  Top Layer w1.27: U3.5 35.18,29.61 33.42,29.61 33.42,30.56 v1(33.48,30.63) v1(33.48,31.39)
  Bottom Layer w0.65: v1(33.48,31.39) v1(33.48,30.63)
  Bottom Layer w1.27: v1(33.48,30.63) 33.48,5.03 33.68,4.84 ; 33.68,4.84 CN1.2 ; 33.68,4.84 39.63,4.84 43.07,8.28 48.4,8.28 50.98,5.7 SW2.1
VBAT_SW: length 37.5
  Top Layer w0.254: R8.1 43.93,30.98 44.41,31.46 U6.1 45.53,32.11 45.79,32.36 47.18,32.36 47.43,32.11 U6.3
  Top Layer w0.65: v1(45.67,27) v1(45.67,27.93) C3.2 45.53,29.5 U6.1
  Bottom Layer w0.65: SW2.2 52.98,6.11 45.61,13.48 v1(45.61,26) 45.61,26.94 v1(45.67,27)
BTN: length 37.2
  Top Layer w0.152: v1(32.38,6.93) SW3.1
  Bottom Layer w0.152: v1(32.38,6.93) 32.38,24.55 31.36,25.57 18.79,25.57 17.8,26.56 H5.2
CHRG: length 4.7
  Top Layer w0.254: U3.7 37.74,28.47 36.15,26.88 34.82,26.88
D0: length 61.3
  Top Layer w0.254: H5.1 20.85,25.67 41.93,25.67 48.28,19.33 53.61,19.33 54.25,19.96 54.25,28.22 55.64,29.61 67.2,29.61 67.96,28.85 67.96,27.96
D3: length 39.4
  Top Layer w0.254: H5.4 12.34,25.8 12.72,25.42 18.24,25.42 18.59,25.77 18.59,28.37 19.07,28.85 21.99,28.85 24.81,26.03 41.65,26.03 42.37,26.76 42.37,27.96 42.43,28.01 R8.2 42.43,30.63 R7.2
LED_B: length 24
  Top Layer w0.254: H6.7 3.57,12.47 3.57,19.87 8.36,24.66 9.73,24.66 10.94,25.87 10.94,28.47 11.38,28.91 R2.1
LED_G: length 27.5
  Top Layer w0.254: v1(12.29,30.12) 13.18,30.12 R5.1
  Bottom Layer w0.254: v1(12.29,30.12) 6.24,30.12 3.32,27.2 3.32,12.47 H6.8
LED_R: length 6.8
  Top Layer w0.254: 13.25,31.2 13.06,31.39 12.46,31.39 9.8,28.72 H5.5
PROG: length 5
  Top Layer w0.254: R1.1 40.91,36.32 40.76,36.47 37.99,36.47 37.74,36.22 U3.2
RGB_B: length 3.7
  Top Layer w0.254: U1.4 17.26,29.2 16.97,28.91 R2.2
RGB_G: length 3.7
  Top Layer w0.203: R5.2 15.7,30.06 16.15,30.5 16.15,31.31 16.54,31.71 U1.3
RGB_R: length 6.2
  Top Layer w0.203: v1(15.46,31.39) 14.94,31.39 14.75,31.2
  Top Layer w0.254: U1.2 20.3,30.25 v1(18.69,30.25)
  Bottom Layer w0.203: v1(15.46,31.39) 16.6,30.25 v1(18.69,30.25)
SCL: length 80.9
  Top Layer w0.254: H6.4 12.34,9.16 R4.2 12.97,8.65 13.09,8.53 20.21,8.53 23.77,12.09 42.31,12.09 47.26,17.04 49.8,17.04 50.56,17.8 DISP1.3
  Bottom Layer w0.254: U4.3 68.09,15.26 69.17,14.18 69.17,9.23 66.57,6.62 54.63,6.62 52.34,8.91 52.34,17.67 51.96,18.06 DISP1.3
SDA: length 82
  Top Layer w0.254: U4.4 69.11,16.66 69.11,9.17 67.96,8.02 54.63,8.02 52.98,9.67 52.98,14.25 51.71,15.52 DISP1.4 50.56,15.77 49.8,16.53 47.39,16.53 42.43,11.58 24.02,11.58 20.41,7.97 11.11,7.97 ; H6.5 9.8,8.4 10.23,7.97 11.11,7.97 ; 11.11,7.97 R3.2
STDBY: length 2.9
  Top Layer w0.254: 34.82,28.02 35.89,28.02 36.47,28.6 U3.6
$1N21492: length 1.8
  Top Layer w0.254: LED5.1 31.93,26.82 R9.1
$1N21493: length 1.9
  Top Layer w0.254: 31.8,28.47 32.06,28.22 R10.1
$1N21507: length 5.4
  Top Layer w0.65: 45.53,33.66 45.53,34.23 46.24,34.95 48.28,34.95 48.72,34.5 48.72,33.35

## Copper pours and planes (outline as drawn; the poured copper is in the pictures)
GND on Top Layer: -0.75,39.64 70.76,39.64 70.76,-1.25 -0.75,-1.25
GND on Bottom Layer: -3.28,40.79 76.6,40.79 76.6,-4.3 -3.28,-4.3
VBAT_SW on Top Layer: 45.1,28.22 46.24,28.22 46.24,25.67 45.1,25.67
VBAT_SW on Bottom Layer: 45.1,28.22 46.12,28.22 46.12,25.67 45.1,25.67

## Text on the board
Bottom Silkscreen Layer: D5 (LED_G) | D6 (LED_B) | R | GND | G | B | SW3 | BTN | SCL | 3V3 | SDA | D0 | On | Off | 5V | D7 | D3(Vot-Div) | D2 | D10 | D20 | Battery | D21 | D0 (INT) | Power | VBAT | VBAT_SW | ESP32-C3 Supermini | + | - | SSD1306 | MPU6050 GY-521 | V1.2WA | Stonez56創客工坊
Top Silkscreen Layer: D3(Vol-Div) | D2 | BTN | D0(INT) | Battery | VBAT | VBAT_SW | G | B | GND | R | SCL | 3V3 | D0 | SDA | USB-C | 5V | LED_G | LED_B | D7 | LED_R | D10 | D20 | D21 | On | Off | Power | + | - | SSD1306 | MPU6050 GY-521 | ESP32-C3 Supermini | V1.2WA | Stonez56創客工坊
